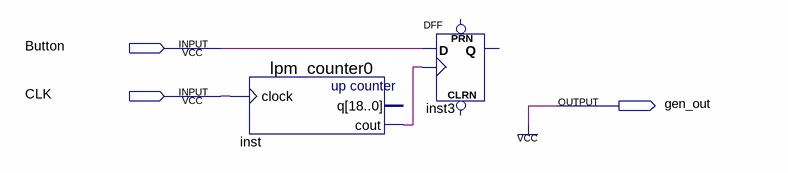
[diagram p0: schematic sheet]
// Quartus schematic scheme3.bdf as structural Verilog: 2 symbols, 3 pins
module scheme3 (
  input  Button,
  input  CLK,
  output gen_out
);

  wire inst_cout;

  lpm_counter0 inst (.clock(CLK), .cout(inst_cout));  // open: q
  DFF inst3 (.CLK(inst_cout), .D(Button));  // open: CLRN, PRN, Q

  assign gen_out = 1'b1;
endmodule
